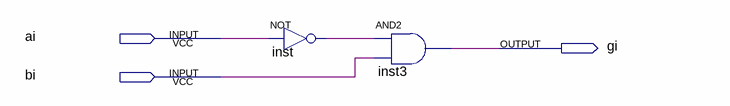
[diagram p0: schematic sheet]
// Quartus schematic borrow_generate.bdf as structural Verilog: 2 symbols, 3 pins
module borrow_generate (
  input  ai,
  input  bi,
  output gi
);

  wire inst_out;

  not inst (inst_out, ai);
  and inst3 (gi, inst_out, bi);
endmodule
